# EAGLE design V1 (EAGLE 7.4.0)
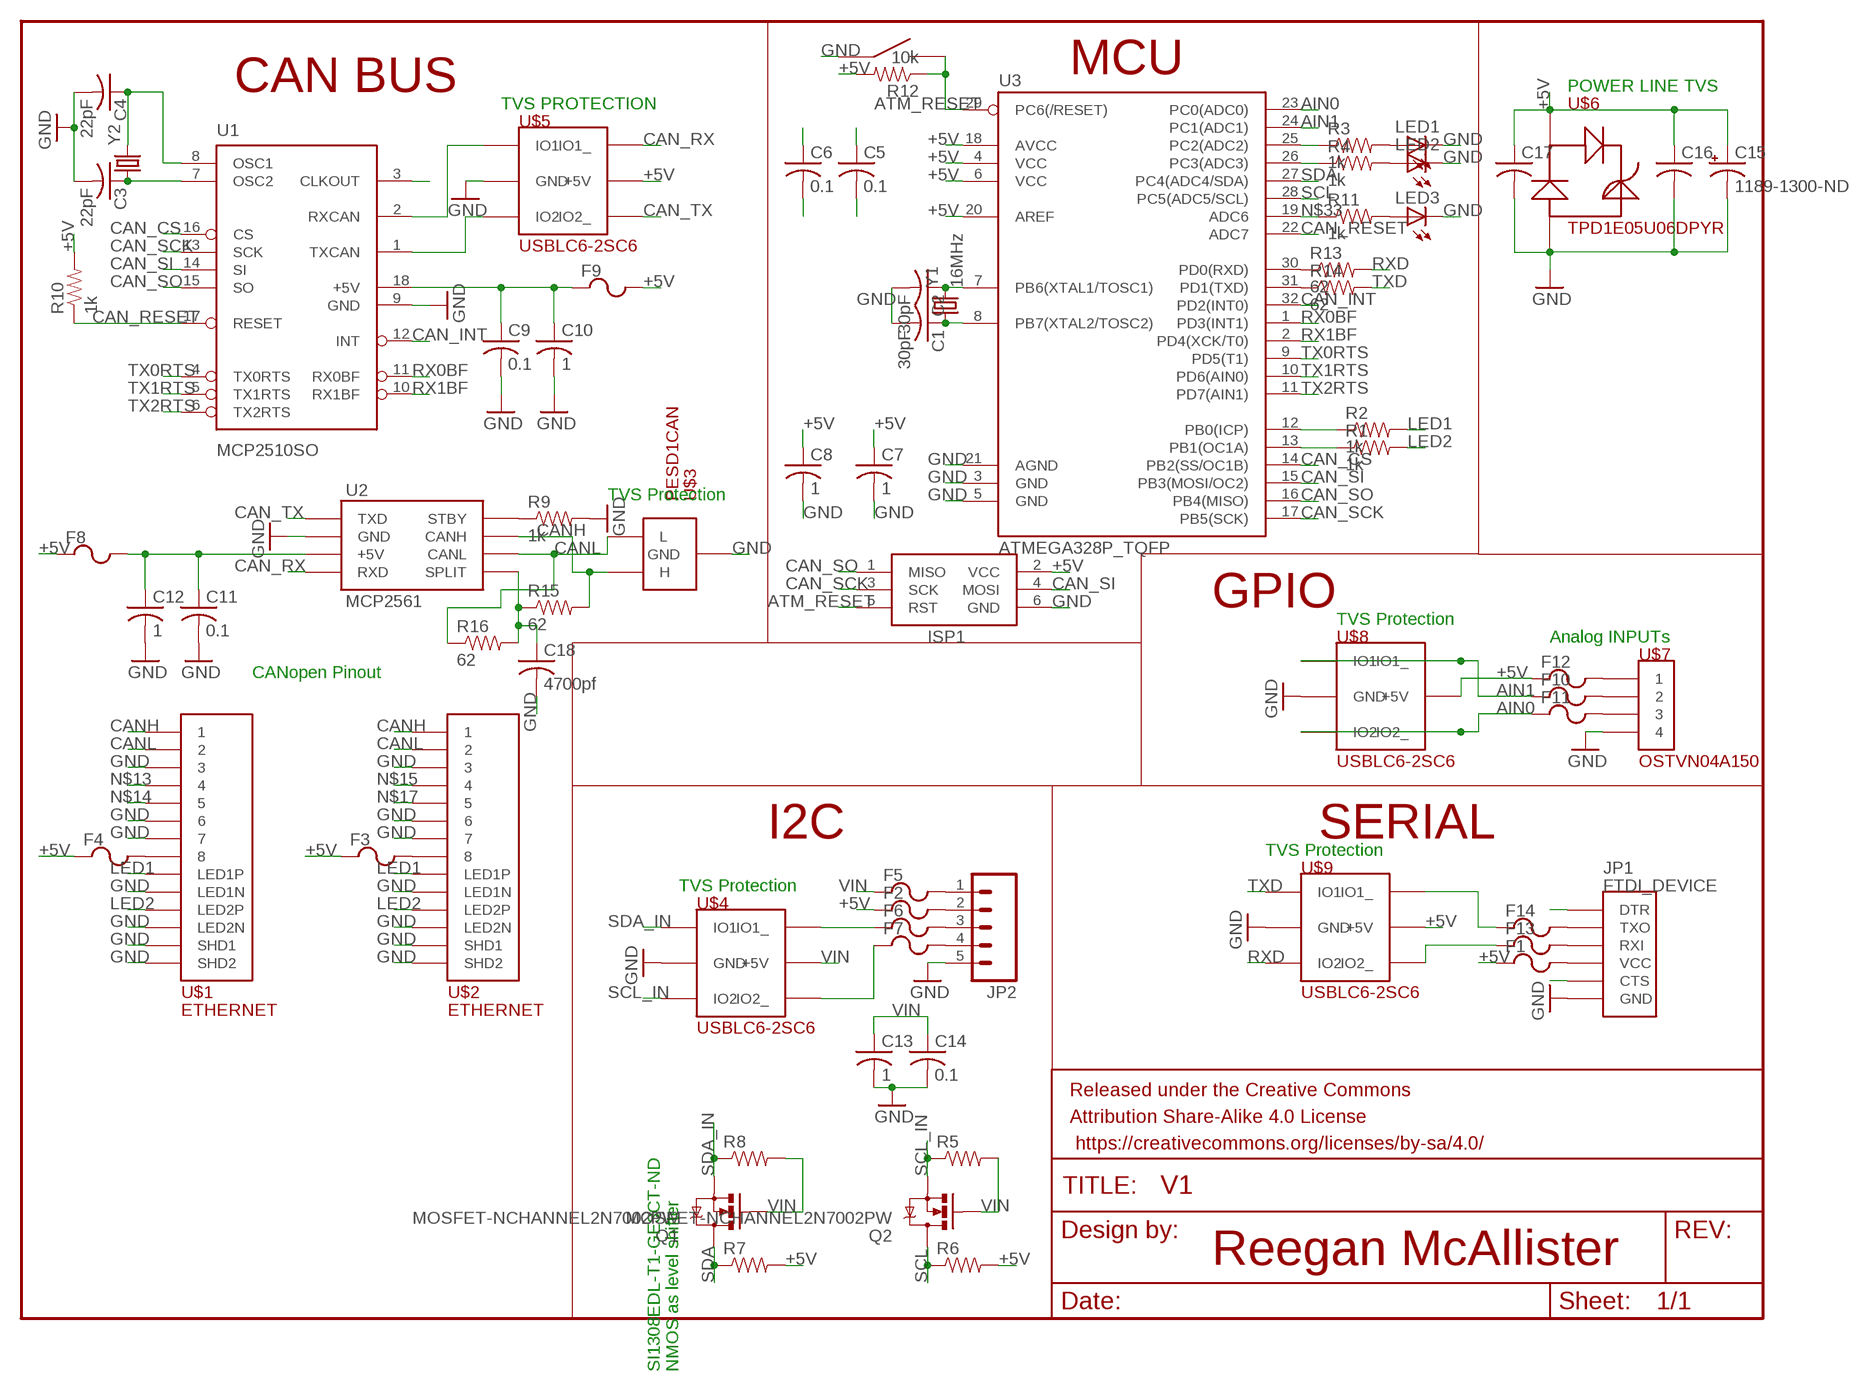
[diagram p0: schematic, sheet 1]

## Parts
C1  30pF  C-USC0603K  [C0603K]
C2  30pF  C-USC0603K  [C0603K]
C3  22pF  C-USC0603K  [C0603K]
C4  22pF  C-USC0603K  [C0603K]
C5  0.1  C-USC0603K  [C0603K]
C6  0.1  C-USC0603K  [C0603K]
C7  1  C-USC0603K  [C0603K]
C8  1  C-USC0603K  [C0603K]
C9  0.1  C-USC0603K  [C0603K]
C10  1  C-USC0603K  [C0603K]
C11  0.1  C-USC0603K  [C0603K]
C12  1  C-USC0603K  [C0603K]
C13  1  C-USC0603K  [C0603K]
C14  0.1  C-USC0603K  [C0603K]
C15  1189-1300-ND  [1189-1300-ND]
C16  C-USC0603K  [C0603K]
C17  C-USC0603K  [C0603K]
C18  4700pf  C-USC0603K  [C0603K]
F1  POLYFUSE  [1206]
F2  POLYFUSE  [1206]
F3  POLYFUSE  [1206]
F4  POLYFUSE  [1206]
F5  POLYFUSE  [1206]
F6  POLYFUSE  [1206]
F7  POLYFUSE  [1206]
F8  POLYFUSE  [1206]
F9  POLYFUSE  [1206]
F10  POLYFUSE  [1206]
F11  POLYFUSE  [1206]
F12  POLYFUSE  [1206]
F13  POLYFUSE  [1206]
F14  POLYFUSE  [1206]
FRAME1  FRAME-LETTERNO_PACKAGE  [DUMMY]
ISP1  AVRISP-BOX  [AVRISP-BOX]
JP1  FTDI_DEVICE  [FTDI_DEVICE_SIDE]
JP2  M05NO_SILK  [1X05_NO_SILK]
LED1  LEDCHIPLED_0805  [CHIPLED_0805]
LED2  LEDCHIPLED_0805  [CHIPLED_0805]
LED3  LEDCHIPLED_0805  [CHIPLED_0805]
Q1  MOSFET-NCHANNEL2N7002PW  [SOT323]
Q2  MOSFET-NCHANNEL2N7002PW  [SOT323]
R1  1k  RESISTOR0603-RES  [0603-RES]
R2  1k  RESISTOR0603-RES  [0603-RES]
R3  1k  RESISTOR0603-RES  [0603-RES]
R4  1k  RESISTOR0603-RES  [0603-RES]
R5  RESISTOR0603-RES  [0603-RES]
R6  RESISTOR0603-RES  [0603-RES]
R7  RESISTOR0603-RES  [0603-RES]
R8  RESISTOR0603-RES  [0603-RES]
R9  1k  RESISTOR0603-RES  [0603-RES]
R10  1k  RESISTOR0603-RES  [0603-RES]
R11  1k  RESISTOR0603-RES  [0603-RES]
R12  10k  RESISTOR0603-RES  [0603-RES]
R13  62  RESISTOR0603-RES  [0603-RES]
R14  62  RESISTOR0603-RES  [0603-RES]
R15  62  RESISTOR0603-RES  [0603-RES]
R16  62  RESISTOR0603-RES  [0603-RES]
U1  MCP2510SO  [SO-18W]
U2  MCP2561  [DIP8]
U3  ATMEGA328P_TQFP  [TQFP32-08]
U$1  ETHERNET  [A122645-ND]
U$2  ETHERNET  [A122645-ND]
U$3  PESD1CAN  [PESD1CAN]
U$4  USBLC6-2SC6  [USBLC6-2SC6]
U$5  USBLC6-2SC6  [USBLC6-2SC6]
U$6  TPD1E05U06DPYR  [2-XDFN]
U$7  OSTVN04A150  [OSTVN04A1450]
U$8  USBLC6-2SC6  [USBLC6-2SC6]
U$9  USBLC6-2SC6  [USBLC6-2SC6]
U$10  EG4621CT-ND  [EG4621CT-ND]
Y1  16MHz  CRYSTALHC49US  [HC49US]
Y2  CRYSTALHC49US  [HC49US]

## Nets
+5V: C5.1 C6.1 C7.1 C8.1 C15.P$2(+) C16.1 C17.1 F1.1 F2.1 F3.1 F4.1 F8.1 F9.2 F12.1 ISP1.2(VCC) R6.2 R7.2 R10.2 R12.2 U3.4(VCC) U3.6(VCC) U3.18(AVCC) U3.20(AREF) U$5.P$5(+5V) U$6.P$1 U$8.P$5(+5V) U$9.P$5(+5V)
AIN0: F11.1 U3.23(PC0(ADC0)) U$8.P$3(IO2) U$8.P$4(IO2_)
AIN1: F10.1 U3.24(PC1(ADC1)) U$8.P$1(IO1) U$8.P$6(IO1_)
ATM_RESET: ISP1.5(RST) R12.1 U3.29(PC6(/RESET)) U$10.P$3 U$10.P$4
CAN_CS: U1.16(CS) U3.14(PB2(SS/OC1B))
CAN_INT: U1.12(INT) U3.32(PD2(INT0))
CAN_RESET: R10.1 U1.17(RESET) U3.22(ADC7)
CAN_RX: U2.P$4(RXD) U$5.P$6(IO1_)
CAN_SCK: ISP1.3(SCK) U1.13(SCK) U3.17(PB5(SCK))
CAN_SI: ISP1.4(MOSI) U1.14(SI) U3.15(PB3(MOSI/OC2))
CAN_SO: ISP1.1(MISO) U1.15(SO) U3.16(PB4(MISO))
CAN_TX: U2.P$1(TXD) U$5.P$4(IO2_)
CANH: R15.2 U2.P$7(CANH) U$1.P$1 U$2.P$1 U$3.P$1(H)
CANL: R16.1 U2.P$6(CANL) U$1.P$2 U$2.P$2 U$3.P$2(L)
GND: C1.2 C2.2 C3.2 C4.2 C5.2 C6.2 C7.2 C8.2 C9.2 C10.2 C11.2 C12.2 C13.2 C14.2 C15.P$1(-) C16.2 C17.2 C18.2 ISP1.6(GND) JP1.P$6(GND) JP2.5 LED1.C LED2.C LED3.C R9.2 U1.9(GND) U2.P$2(GND) U3.3(GND) U3.5(GND) U3.21(AGND) U$1.P$3 U$1.P$6 U$1.P$7 U$1.P$9(LED1N) U$1.P$11(LED2N) U$1.P$13(SHD1) U$1.P$14(SHD2) U$2.P$3 U$2.P$6 U$2.P$7 U$2.P$9(LED1N) U$2.P$11(LED2N) U$2.P$13(SHD1) U$2.P$14(SHD2) U$3.P$3(GND) U$4.P$2(GND) U$5.P$2(GND) U$6.P$2 U$7.P$4 U$8.P$2(GND) U$9.P$2(GND) U$10.P$1 U$10.P$2
LED1: R2.2 U$1.P$10(LED1P) U$2.P$10(LED1P)
LED2: R1.2 U$1.P$12(LED2P) U$2.P$12(LED2P)
N$1: F3.2 U$2.P$8
N$2: R1.1 U3.13(PB1(OC1A))
N$3: R3.1 U3.25(PC2(ADC2))
N$4: R2.1 U3.12(PB0(ICP))
N$5: U1.3(CLKOUT)
N$6: C4.1 U1.8(OSC1) Y2.2
N$7: C3.1 U1.7(OSC2) Y2.1
N$8: C2.1 U3.7(PB6(XTAL1/TOSC1)) Y1.2
N$9: C1.1 U3.8(PB7(XTAL2/TOSC2)) Y1.1
N$10: F10.2 U$7.P$2
N$11: JP1.P$1(DTR)
N$12: JP1.P$5(CTS)
N$13: U$1.P$4
N$14: U$1.P$5
N$15: U$2.P$4
N$16: F11.2 U$7.P$3
N$17: U$2.P$5
N$18: LED1.A R3.2
N$20: LED2.A R4.2
N$21: F1.2 JP1.P$4(VCC)
N$22: F2.2 JP2.2
N$23: F4.2 U$1.P$8
N$24: F5.2 JP2.1
N$25: F6.2 JP2.3
N$26: F7.2 JP2.4
N$27: F6.1 U$4.P$6(IO1_)
N$28: F7.1 U$4.P$4(IO2_)
N$29: C11.1 C12.1 F8.2 U2.P$3(+5V)
N$30: C9.1 C10.1 F9.1 U1.18(+5V)
N$31: U1.1(TXCAN) U$5.P$3(IO2)
N$32: U1.2(RXCAN) U$5.P$1(IO1)
N$33: R11.1 U3.19(ADC6)
N$34: F12.2 U$7.P$1
N$35: R9.1 U2.P$8(STBY)
N$36: R4.1 U3.26(PC3(ADC3))
N$37: LED3.A R11.2
N$38: R13.1 U3.30(PD0(RXD))
N$39: R14.1 U3.31(PD1(TXD))
N$40: F13.2 JP1.P$3(RXI)
N$41: F14.2 JP1.P$2(TXO)
N$42: F14.1 U$9.P$6(IO1_)
N$43: F13.1 U$9.P$4(IO2_)
N$45: C18.1 R15.1 R16.2 U2.P$5(SPLIT)
RX0BF: U1.11(RX0BF) U3.1(PD3(INT1))
RX1BF: U1.10(RX1BF) U3.2(PD4(XCK/T0))
RXD: R13.2 U$9.P$3(IO2)
SCL: Q2.3(D) R6.1 U3.28(PC5(ADC5/SCL))
SCL_IN: Q2.2(S) R5.1 U$4.P$3(IO2)
SDA: Q1.3(D) R7.1 U3.27(PC4(ADC4/SDA))
SDA_IN: Q1.2(S) R8.1 U$4.P$1(IO1)
TX0RTS: U1.4(TX0RTS) U3.9(PD5(T1))
TX1RTS: U1.5(TX1RTS) U3.10(PD6(AIN0))
TX2RTS: U1.6(TX2RTS) U3.11(PD7(AIN1))
TXD: R14.2 U$9.P$1(IO1)
VIN: C13.1 C14.1 F5.1 Q1.1(G) Q2.1(G) R5.2 R8.2 U$4.P$5(+5V)

## Notes on the sheet
- MCU
- CAN BUS | POWER LINE TVS
- TVS PROTECTION
- TVS Protection
- GPIO
- TVS Protection
- Analog INPUTs
- CANopen Pinout
- I2C | SERIAL
- TVS Protection
- TVS Protection
- Reegan McAllister
- SI1308EDL-T1-GE3CT-ND 
  NMOS as level shifter

## Library data of the parts
C1-C14 C16-C18 = adafruit:C-US: CAPACITOR, American symbol
C15 = SparkFun-Capacitors-extra:1189-1300-ND
F1-F14 = polyfuse:POLYFUSE: Resistor Basic schematic elements and footprints for 0603, 1206, and PTH resistors.
FRAME1 = SparkFun-Aesthetics:FRAME-LETTER: Schematic Frame Standard 8.5x11 US Letter frame; DESIGNER: Nobody; VERSION: v01
ISP1 = adafruit:AVRISP: AVR ISP HEADER Standard 6 pin header for AVR programming
JP1 = SparkFun-Connectors:FTDI_DEVICE: Connector which mates to FTDI basic or FTDI cable.
JP2 = SparkFun-Connectors:M05: Header 5 Standard 5-pin 0.1" header. Use with straight break away headers (SKU : PRT-00116), right angle break away headers (PRT-00553), swiss pins (PRT-00743), machine pins (PRT-00117), and female headers (PRT-00115). Molex polarized connector foot print use with SKU : PRT-08230 with associated crimp pins and housings.
LED1-LED3 = adafruit:LED: LED OSRAM: - CHIPLED LG R971, LG N971, LY N971, LG Q971, LY Q971, LO R971, LY R971 LH N974, LH R974 LS Q976, LO Q976, LY Q976 LO Q996 - Hyper CHIPLED LW Q18S LB Q993, LB Q99A, LB R99A - SideLED LS A670, LO A670, LY A670, LG A670, LP A670 LB A673, LV A673, LT A673, LW A673 LH A674 LY A675 LS A676, LA A676, LO A676, LY A676, LW A676 LS A679, LY A679, LG A679 - Hyper Micro SIDELED® LS Y876, LA Y876, LO Y876, LY Y876 LT Y87S - SmartLED LW L88C, LW L88S LB L89C, LB L89S, LG L890 LS L89K, LO L89K, LY L89K LS L896, LA L896, LO L896, LY L896 - TOPLED LS T670, LO T670, LY T670, LG T670, LP T670 LSG T670, LSP T670, LSY T670, LOP T670, LYG T670 LG T671, LOG T671, LSG T671 LB T673, LV T673, LT T673, LW T673 LH T674 LS T676, LA T676, LO T676, LY T676, LB T676, LH T676, LSB T676, LW T676 LB T67C, LV T67C, LT T67C, LS T67K, LO T67K, LY T67K, LW E67C LS E67B, LA E67B, LO E67B, LY E67B, LB E67C, LV E67C, LT E67C LW T67C LS T679, LY T679, LG T679 LS T770, LO T770, LY T770, LG T770, LP T770 LB T773, LV T773, LT T773, LW T773 LH T774 LS E675, LA E675, LY E675, LS T675 LS T776, LA T776, LO T776, LY T776, LB T776 LHGB T686 LT T68C, LB T68C - Hyper Mini TOPLED® LB M676 - Mini TOPLED Santana® LG M470 LS M47K, LO M47K, LY M47K Source: http://www.osram.convergy.de/
Q1 Q2 = E-P-008-R1.2:MOSFET-NCHANNEL: Common NMOSFET Parts MFG P/N Store ID Prod ID FDD8780 TRANS-09984 SI7820DN TRANS-11055 FDS6630A IC-08089 2N7002PW TRANS-11151 FQP30N06L COM-10213 TRANS-10060 BSS123LT1G TRANS-08345 BSS138 TRANS-00830 BS170 2N7000; PROD_ID: TRANS-11151
R1-R16 = SparkFun-Resistors:RESISTOR: Resistor Basic schematic elements and footprints for 0603, 1206, and PTH resistors.
U1 = SparkFun-DigitalIC:MCP2510: CAN controller with SPI interface to any MCU. Original design by Microchip.; PROD_ID: IC-09906
U2 = mcp2561:MCP2561: CAN transceiver
U3 = SparkFun-DigitalIC:ATMEGA328P_TQFP; PROD_ID: IC-09069
U$1 U$2 = ETHERNET:ETHERNET: Ethernet port with 2 leds. digikey number A122645-ND
U$3 = PESD1CAN:PESD1CAN: TVS diode ESD protection specifically designed for CAN bus data lines
U$4 U$5 U$8 U$9 = USBLC6-2SC6:USBLC6-2SC6: 5V TSV diode for protecting circuit board inputs. Also has Vcc Protection. Digikey 497-5235-6-ND
U$6 = TPD1E05U06DPYR:TPD1E05U06DPYR: 5V general purpose TVS diode for ESD protection
U$7 = OSTVN04A150:OSTVN04A150: 4 port screw terminal. digikey number ED10563-ND
U$10 = EG4621CT-ND:EG4621CT-ND: surface mount push putton digikey number EG4621CT-ND
Y1 Y2 = SparkFun-FreqCtrl:CRYSTAL: Various standard crystals. Proven footprints.

## Board
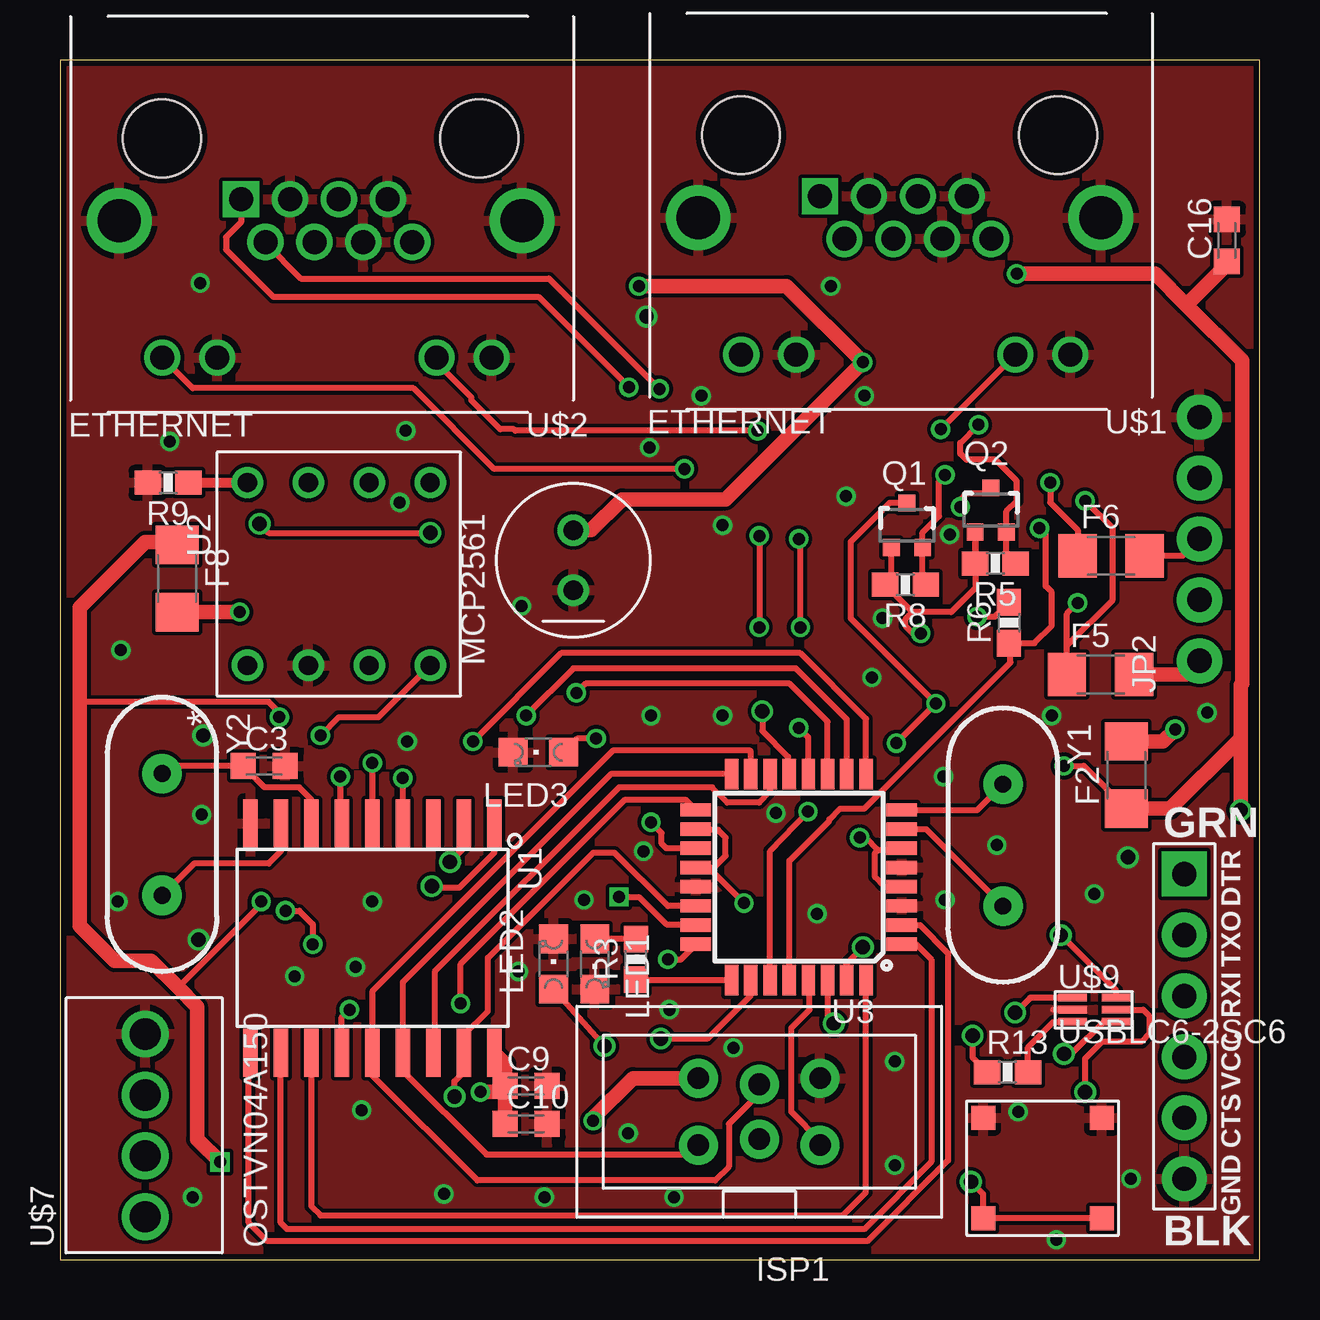
[diagram p1: board, top side]
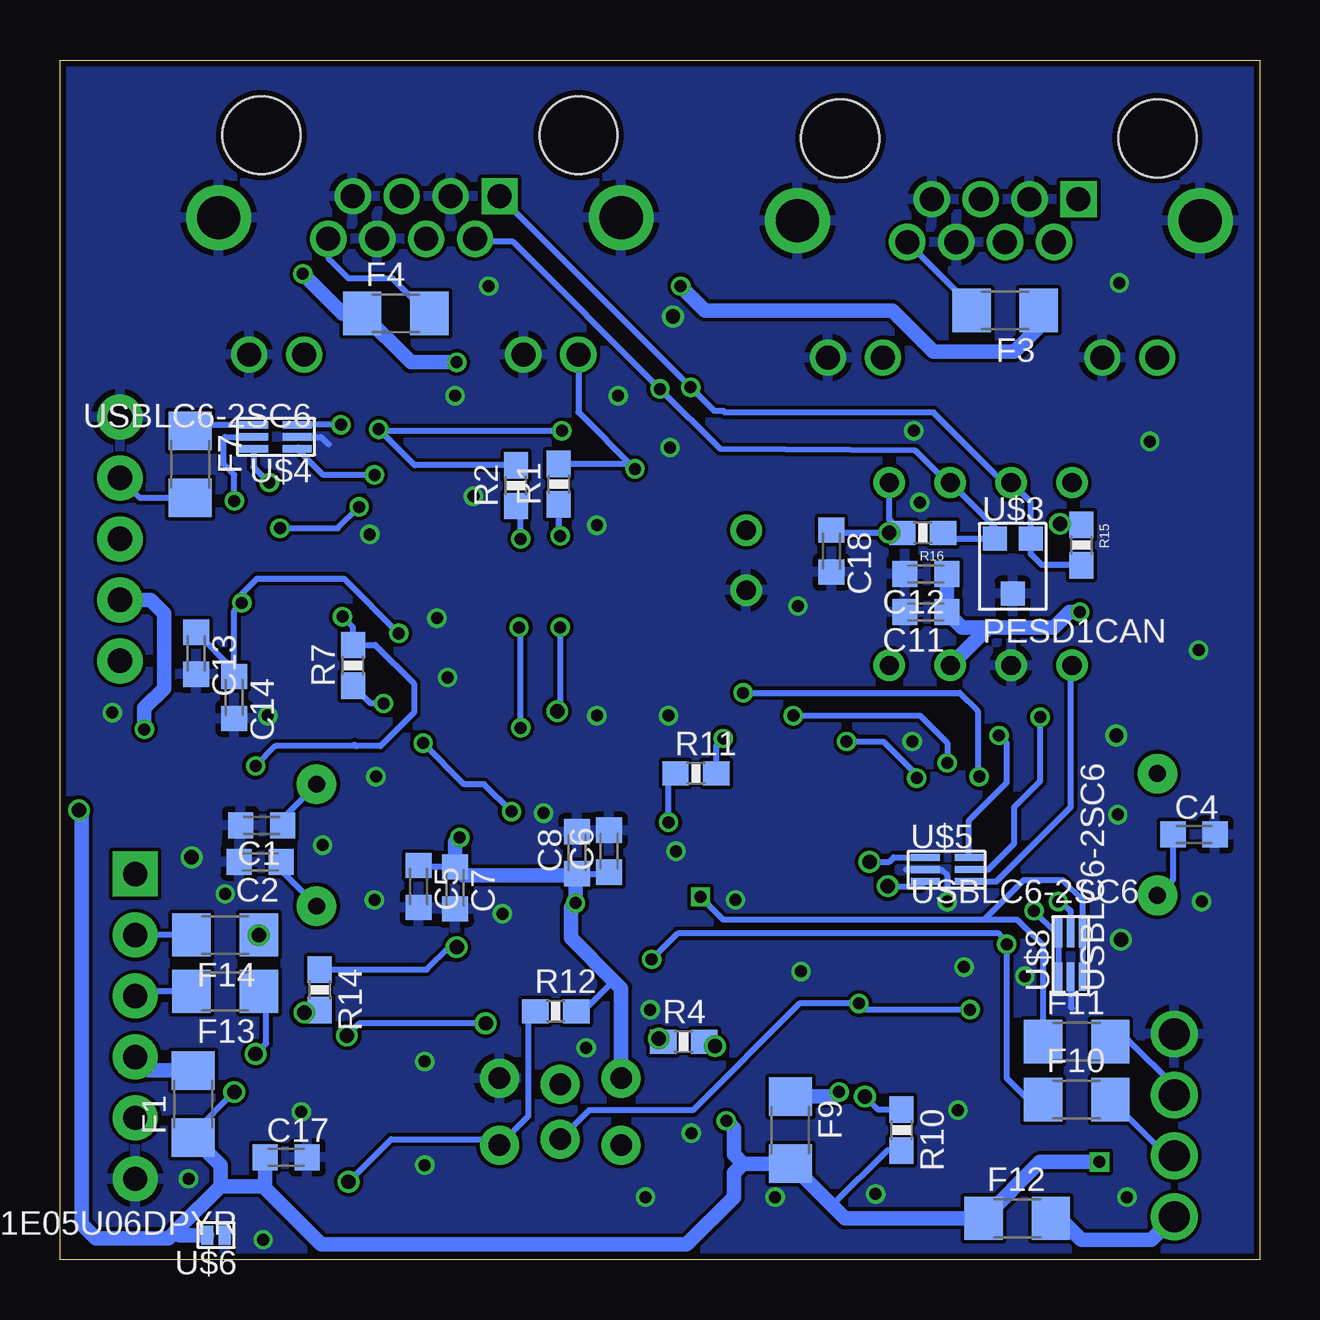
[diagram p2: board, bottom side, seen from below]

Size 50 x 50 mm. Coordinates in mm from the lower left corner, seen from the top.
Outline: 0,0 50,0 50,50 0,50 0,0
Copper layers (1*16): Top 0.035mm / dielectric 1.5mm / Bottom 0.035mm
Design rules "SeeedStudio_2layer_DRU_no_angle_20140221": minimum track width 6mil, minimum drill 12mil, track to track 6mil, track to pad 6mil, pad to pad 6mil, via to via 6mil, smd to smd 0mil, copper to edge 10mil, drill to drill 10mil, minimum pad ring 10mil, minimum via ring 6mil, stop-mask expansion 2mil, vias tented up to drill 100mil, thermal gap 10mil

### Footprints (pad centres in the part's own frame; a part is rotated, then mirrored left to right if it is on the bottom)
C0603K = smd 1.05 x 1.08: 1 -0.875,0; 2 0.875,0
1189-1300-ND = drill 0.8: P$1 -1.25,0; P$2 1.25,0
1206 = smd 1.6 x 1.8: 1 -1.4,0; 2 1.4,0
AVRISP-BOX = drill 0.9 pad 1.626: 1 -1.397,2.54; 2 1.397,2.54; 3 -1.143,0; 4 1.143,0; 5 -1.397,-2.54; 6 1.397,-2.54
FTDI_DEVICE_SIDE = drill 1.016 pad 1.88 square: P$1 -6.35,0 | drill 1.016 pad 1.88: P$2 -3.81,0; P$3 -1.27,0; P$4 1.27,0; P$5 3.81,0; P$6 6.35,0
1X05_NO_SILK = drill 1.016 pad 1.88: 1 0,0; 2 2.54,0; 3 5.08,0; 4 7.62,0; 5 10.16,0
CHIPLED_0805 = smd 1.2 x 1.2: A 0,-1.05; C 0,1.05
SOT323 = smd 0.7 x 0.7: 1 -0.65,-0.925; 2 0.65,-0.925; 3 0,0.925
0603-RES = smd 1.1 x 1: 1 -0.85,0; 2 0.85,0
SO-18W = smd 0.6 x 2: 1 -5.08,-4.788; 2 -3.81,-4.788; 3 -2.54,-4.788; 4 -1.27,-4.788; 5 0,-4.788; 6 1.27,-4.788; 7 2.54,-4.788; 8 3.81,-4.788; 9 5.08,-4.788; 10 5.08,4.788; 11 3.81,4.788; 12 2.54,4.788; 13 1.27,4.788; 14 0,4.788; 15 -1.27,4.788; 16 -2.54,4.788; 17 -3.81,4.788; 18 -5.08,4.788
DIP8 = drill 0.8: P$1 -3.81,6.35; P$2 -3.81,3.81; P$3 -3.81,1.27; P$4 -3.81,-1.27; P$5 3.81,-1.27; P$6 3.81,1.27; P$7 3.81,3.81; P$8 3.81,6.35
TQFP32-08 = smd 1.27 x 0.559: 1 -4.293,2.8; 2 -4.293,2; 3 -4.293,1.2; 4 -4.293,0.4; 5 -4.293,-0.4; 6 -4.293,-1.2; 7 -4.293,-2; 8 -4.293,-2.8; 17 4.293,-2.8; 18 4.293,-2; 19 4.293,-1.2; 20 4.293,-0.4; 21 4.293,0.4; 22 4.293,1.2; 23 4.293,2; 24 4.293,2.8 | smd 0.559 x 1.27: 9 -2.8,-4.293; 10 -2,-4.293; 11 -1.2,-4.293; 12 -0.4,-4.293; 13 0.4,-4.293; 14 1.2,-4.293; 15 2,-4.293; 16 2.8,-4.293; 25 2.8,4.293; 26 2,4.293; 27 1.2,4.293; 28 0.4,4.293; 29 -0.4,4.293; 30 -1.2,4.293; 31 -2,4.293; 32 -2.8,4.293
A122645-ND = drill 1 square: P$1 3.06,2.54 | drill 1: P$2 2.04,4.32; P$3 1.02,2.54; P$4 0,4.32; P$5 -1.02,2.54; P$6 -2.04,4.32; P$7 -3.06,2.54; P$8 -4.08,4.32; P$9 -7.38,9.14; P$10 -5.09,9.14; P$11 4.05,9.14; P$12 6.34,9.14 | drill 1.8: P$13 -8.65,3.43; P$14 8.13,3.43 | hole 3.25: -6.87,0; 6.35,0
PESD1CAN = smd 1 x 1: P$1 0.75,1.8; P$2 -0.75,1.8; P$3 0,-0.5
USBLC6-2SC6 = smd 0.3 x 1.2: P$1 -0.5,-0.91; P$2 0,-0.91; P$3 0.5,-0.91; P$4 0.5,0.91; P$5 0,0.91; P$6 -0.5,0.91
2-XDFN = smd 0.5 x 0.8: P$1 0.36,0; P$2 -0.36,0
OSTVN04A1450 = drill 1.3: P$1 -3.81,0; P$2 -1.27,0; P$3 1.27,0; P$4 3.81,0
EG4621CT-ND = smd 1 x 1: P$1 -2.475,2.1; P$2 2.475,2.1; P$3 -2.475,-2.1; P$4 2.475,-2.1
HC49US = drill 0.7 pad 1.651: 1 -2.54,0; 2 2.54,0

### Placement (x,y rotation side)
C1  41.59,18.1 180 bottom
C2  41.66,16.57 180 bottom
C3  8.51,20.57 0 top
C4  2.73,17.72 0 bottom
C5  35.05,15.56 270 bottom
C6  27.11,17.02 90 bottom
C7  33.53,15.49 270 bottom
C8  28.45,16.95 90 bottom
C9  19.43,7.24 0 top
C10  19.43,5.65 0 top
C11  13.91,26.99 180 bottom
C12  13.91,28.57 180 bottom
C13  44.32,25.27 270 bottom
C14  42.74,23.43 270 bottom
C15  21.4,29.15 90 top
C16  48.64,42.48 90 top
C17  40.58,4.25 0 bottom
C18  17.84,29.53 270 bottom
F1  44.45,6.48 90 bottom
F2  44.45,20.19 90 top
F3  10.6,39.56 180 bottom
F4  36,39.43 0 bottom
F5  43.37,24.38 0 top
F6  43.81,29.34 0 top
F7  44.58,33.15 270 bottom
F8  4.89,28.38 270 top
F9  19.56,5.4 270 bottom
F10  7.62,6.67 0 bottom
F11  7.62,9.08 0 bottom
F12  10.1,1.71 0 bottom
F13  43.12,11.18 180 bottom
F14  43.12,13.53 180 bottom
FRAME1  -30.48,19.05 0 top  (outside the outline)
ISP1  29.15,6.16 90 top
JP1  46.86,9.72 270 top
JP2  47.5,24.96 90 top
LED1  22.29,12.32 180 top
LED2  20.57,12.32 0 top
LED3  19.94,21.15 90 top
Q1  35.31,30.61 0 top
Q2  38.8,31.24 0 top
R1  29.21,32.32 90 bottom
R2  30.99,32.26 90 bottom
R3  24,12.51 90 top
R4  24,9.08 0 bottom
R5  38.99,29.02 180 top
R6  39.56,26.54 90 top
R7  37.78,24.77 90 bottom
R8  35.24,28.13 180 top
R9  4.51,32.38 180 top
R10  14.92,5.4 270 bottom
R11  23.5,20.26 0 bottom
R12  29.34,10.35 0 bottom
R13  39.5,7.81 0 top
R14  39.18,11.24 270 bottom
R15  7.43,29.78 270 bottom
R16  14.03,30.29 180 bottom
U1  13.02,13.4 180 top
U2  14.16,28.57 90 top
U3  30.8,15.94 180 top
U$1  34.73,46.86 180 top
U$2  10.6,46.74 180 top
U$3  10.29,28.26 0 bottom
U$4  41.02,34.29 90 bottom
U$5  13.02,16.26 270 bottom
U$6  43.5,1.02 180 bottom
U$7  3.56,5.59 90 top
U$8  7.87,12.7 0 bottom
U$9  43.12,10.41 270 top
U$10  40.96,3.81 0 top
Y1  39.31,17.27 270 top
Y2  4.25,17.72 270 top

### Tracks (layer width: path | path; a pad name or v marks a point on that pad's centre or on a via)
+5V  (via drill 0.5, 0.6)
  Top 0.254: 28.57,14.8 v28.51,14.86 27.03,16.34 U3.20 27.26,16.34 27.75,16.83 27.75,17.59 27.43,17.91 26.54,17.91 U3.18 | U3.4 34.37,15.54 33.97,15.94 33.97,16.95 34.1,17.08 | 34.1,17.08 35.03,17.08 U3.6 | v33.34,17.59 33.59,17.59 34.1,17.08 | 49.09,21.59 49.28,24 49.21,23.94 | v41.85,20.57 42.67,20.57 F2.1 | v38.23,26.8 38.97,26.8 R6.2 | v9.14,22.61 9.14,22.8 8.7,23.24 1.08,23.24 0.83,22.99 | v8.38,14.92 8.26,14.67 4.92,11.34 | U$9.P$5 45.15,10.41 45.4,10.16 45.4,9.4 45.09,9.08 43.43,9.08 42.74,8.38 v42.74,6.99
  Top 0.61: v24.13,40.58 30.29,40.58 v33.47,37.4 27.75,31.69 23.43,31.69 22.14,30.4 C15.P$2 | F2.1 46.29,18.79 49.09,21.59 | 49.28,24 49.28,37.47 46.96,39.78 | 46.96,39.78 45.66,41.08 v39.88,41.08 | v49.21,18.73 49.21,23.94 | F8.1 4.77,29.91 3.56,29.91 0.83,27.18 0.83,22.99 0.83,13.91 2.29,12.45 3.81,12.45 4.92,11.34 5.71,10.54 5.71,5.02 v6.67,4.06 | v22.23,5.78 22.23,5.91 23.88,7.56 ISP1.2 | C16.1 48.64,41.47 46.96,39.78
  Bottom 0.254: 28.51,16.02 C8.1 27.18,16.08 C6.1 | 33.17,16.02 C7.1 34.99,16.37 C5.1 | 33.53,17.4 v33.34,17.59 | 28.7,14.67 v28.51,14.86 | F3.1 9.2,38.87 | 37.66,21.4 36.64,21.4 35.24,22.8 35.24,24 36.85,25.61 R7.2 37.78,26.35 v38.23,26.8 | 37.66,21.4 37.72,21.46 | 37.66,21.4 41.02,21.4 v41.85,20.57 | U$5.P$5 11.3,16.26 10.22,17.34 10.22,18.86 9.14,19.94 v9.14,22.61 | U$8.P$5 7.87,14.54 v8.38,14.92 | R10.2 15.52,4.55 17.81,2.25 | R12.2 28.19,10.35 26.92,11.62 | F1.1 44.45,5.27 v42.74,6.99
  Bottom 0.61: v28.51,14.86 28.51,16.02 33.17,16.02 | C7.1 33.53,17.4 | 41.53,3.05 39.12,0.64 23.88,0.64 21.91,2.6 21.91,3.61 21.52,4 | v22.23,5.78 21.91,5.46 21.91,4.38 21.52,4 | ISP1.2 26.61,11.3 26.92,11.62 28.7,13.4 28.7,14.67 | 9.2,38.87 10.22,37.85 13.59,37.85 15.3,39.56 23.11,39.56 v24.13,40.58 | v33.47,37.4 35.37,37.4 F4.1 38.23,39.43 v39.88,41.08 | 41.53,3.05 43.31,3.05 | 43.31,3.05 45.02,1.33 | 45.02,1.33 45.47,0.89 48.51,0.89 49.09,1.46 49.09,18.61 v49.21,18.73 | F1.1 43.31,3.93 43.31,3.05 | 21.52,4 F9.2 17.81,2.25 17.27,1.71 F12.1 9.15,4.06 v6.67,4.06 | U$6.P$1 45.02,1.02 45.02,1.33 | C17.1 41.45,3.13 41.53,3.05
AIN0  (via drill 0.5)
  Top 0.254: v23.3,15.11 24.13,15.11 25.27,13.97 26.47,13.97 U3.23
  Bottom 0.254: F11.1 9.02,13.08 10.1,14.16 11.49,14.16 | 11.49,14.16 22.35,14.16 v23.3,15.11 | 11.49,14.16 9.84,15.81 8.19,15.81 7.37,14.99 U$8.P$4 U$8.P$3
AIN1  (via drill 0.5)
  Top 0.254: v25.34,12.51 25.88,12.51 U3.24 | v9.4,14.54 9.97,14.54 10.54,13.97 v10.54,13.14
  Bottom 0.254: F10.1 9.65,6.67 10.54,7.56 10.54,12.83 v10.54,13.14 10.54,13.27 10.86,13.59 24.26,13.59 v25.34,12.51 | U$8.P$1 U$8.P$6 8.47,13.61 v9.4,14.54
ATM_RESET  (via drill 0.6)
  Top 0.254: ISP1.5 31.69,4.95 30.48,6.16 30.48,9.65 31.24,10.41 31.24,11.6 U3.29 | U$10.P$4 U$10.P$3 38.48,2.73 v37.97,3.24
  Bottom 0.254: R12.1 30.48,10.35 30.48,5.97 ISP1.5 31.94,5.02 36.2,5.02 v37.97,3.24
CAN_CS
  Top 0.254: U3.14 29.6,19.5 29.15,19.05 27.81,19.05 27.18,19.68 23.3,19.68 15.62,12 15.62,8.67 U1.16
CAN_INT
  Top 0.254: U1.12 10.48,2.22 10.86,1.84 32.64,1.84 33.59,2.79 U3.32
CAN_RESET  (via drill 0.6)
  Top 0.254: 26.37,14.61 U3.22 | U3.22 | U3.22 25.34,14.73 23.11,16.95 22.23,16.95 17.84,12.57 17.84,10.35 16.83,9.34 U1.17 16.83,7.81 16.45,7.43 v16.45,6.79
  Bottom 0.254: R10.1 15.9,6.25 v16.45,6.79
CAN_RX  (via drill 0.5)
  Top 0.254: v10.86,21.84 11.62,22.61 13.27,22.61 U2.P$4
  Bottom 0.254: U$5.P$6 12.11,18.31 10.54,19.88 10.54,21.53 v10.86,21.84
CAN_SCK  (via drill 0.5)
  Top 0.254: 11.75,8.19 U1.13 11.75,10.1 v12.06,10.41 | U3.17 26.07,19.18 23.56,19.18 16.7,12.32 v16.7,10.67
  Bottom 0.254: v12.06,10.41 16.45,10.41 v16.7,10.67 19.18,10.67 23.62,6.22 27.94,6.22 ISP1.3
CAN_SI
  Top 0.254: U3.15 28.8,21.18 28.77,21.21 23.05,21.21 13.02,11.18 U1.14 13.02,7.68 17.4,3.3 27.3,3.3 27.88,3.87 27.88,5.65 29.15,6.92 ISP1.4
CAN_SO
  Top 0.254: U3.16 22.96,20.23 14.29,11.56 U1.15 14.29,7.87 17.78,4.38 26.23,4.38 ISP1.1
CAN_TX
  Bottom 0.254: U$5.P$4 10.98,15.76 7.87,18.86 7.87,24.7 U2.P$1
CANH  (via drill 0.5)
  Top 0.254: U$2.P$1 7.54,43.23 6.92,42.61 6.92,42.1 8.89,40.13 19.94,40.13 v23.71,36.36
  Bottom 0.254: U$1.P$1 v23.71,36.36 22.72,35.37 22.35,35.37 22.29,35.31 13.59,35.31 10.67,32.38 U2.P$7 9.54,31.57 U$3.P$1 9.54,29.41 9.08,28.96 7.45,28.96 R15.2
CANL  (via drill 0.5)
  Top 0.254: U$2.P$2 8.56,42.36 10.03,40.89 20.38,40.89 v24.99,36.29
  Bottom 0.254: U$1.P$2 32.57,42.42 31.11,42.42 v24.99,36.29 22.48,33.78 14.35,33.72 13.02,32.38 U2.P$6 11.04,30.53 U$3.P$2 12.95,30.06 R16.1
GND  (via drill 0.5, 0.6)
  Top 0.254: U$9.P$2 41.4,10.41
  Bottom 0.254: U$4.P$2 39.12,34.29 38.8,33.97 | 14.73,16.26 U$5.P$2 13.27,16.26 13.02,16 13.02,15.24 | U$8.P$2 7.87,10.54 7.81,10.48
  other vias: 29.84,18.61 27.62,22.67 36.89,14.99 31.56,14.41 24.32,17.02 25.4,10.41 23.69,5.27 34.8,3.94 34.8,8.26 39.94,6.16 28.07,8.83 16,2.73 12.32,12.19 5.97,21.84 5.91,18.54 19.24,27.24 2.54,25.4 19.11,12 21.84,14.99 39.05,17.27 33.85,24.26 33.53,36 24.45,39.31 5.84,40.7 24.64,22.67 41.53,0.83 43.12,15.24 32.13,40.58 47.82,22.8 32.77,31.81 41.34,22.67 36.83,20.13 44.51,16.76 34.29,26.73 14.41,34.54 9.78,11.81 13.02,14.92 5.52,2.6 5.78,13.34 20.19,2.6 25.59,2.6 44.64,3.37 37.08,30.23 26.73,36 4.57,34.1 2.41,14.92 12.57,6.22 27.62,30.61 24.57,33.85 14.16,31.56 14.48,21.59
  pour Bottom: -3.81,52.07 -3.81,-2.54 53.34,-2.54 53.34,52.07
  pour Top: -6.35,52.07 -6.35,-2.54 55.88,-2.54 55.88,52.07
LED1  (via drill 0.5)
  Top 0.254: U$2.P$10 15.69,37.39 17.14,35.94 17.14,35.81 18.35,34.61 18.92,34.61 18.99,34.54 v29.08,34.54 | v36.71,34.61 U$1.P$10
  Bottom 0.254: R2.2 35.21,33.11 v36.71,34.61 36.65,34.54 v29.08,34.54
LED2  (via drill 0.5)
  Top 0.254: v26.04,32.96 18.1,32.96 14.73,36.32 5.54,36.32 U$2.P$12
  Bottom 0.254: U$1.P$12 28.39,35.32 v26.04,32.96 26.25,33.17 R1.2
N$1
  Bottom 0.254: F3.2 12.01,39.74 U$2.P$8
N$2  (via drill 0.5, 0.6)
  Top 0.254: v29.15,30.16 v29.15,26.35 | v29.27,22.86 29.27,22.04 30.35,20.95 30.35,20.28 U3.13
  Bottom 0.254: R1.1 29.21,30.23 v29.15,30.16 | v29.15,26.35 29.15,22.99 v29.27,22.86
N$3
  Top 0.254: R3.1 27.98,11.66 U3.25
N$4  (via drill 0.5)
  Top 0.254: U3.12 31.2,21.76 v30.8,22.16 | v30.86,26.35 30.86,29.97 v30.8,30.04
  Bottom 0.254: v30.8,22.16 30.8,26.29 v30.86,26.35 | v30.8,30.04 30.8,31.22 R2.1
N$6
  Top 0.254: U1.8 9.21,17.02 8.7,16.51 5.59,16.51 Y2.2
  Bottom 0.254: C4.1 3.61,15.82 Y2.2
N$7
  Top 0.254: Y2.1 4.57,20.57 C3.1 8.52,19.68 9.97,19.68 10.48,19.18 U1.7
N$8
  Top 0.254: U3.7 36.1,17.94 Y1.2
  Bottom 0.254: C2.1 40.91,16.33 Y1.2
N$9
  Top 0.254: U3.8 38.23,18.74 Y1.1
  Bottom 0.254: C1.1 40.83,18.29 Y1.1
N$10
  Bottom 0.254: U$7.P$2 3.87,4.32 F10.2
N$16
  Bottom 0.254: U$7.P$3 3.56,7.24 5.46,9.14 6.16,9.14 F11.2
N$18
  Top 0.254: R3.2 22.62,13.36 LED1.A
N$20  (via drill 0.6)
  Top 0.254: v22.7,8.89 LED2.A
  Bottom 0.254: R4.2 v22.7,8.89
N$21
  Bottom 0.61: F1.2 46.29,7.88 JP1.P$4
N$22  (via drill 0.5)
  Top 0.61: F2.2 45.98,21.59 v46.48,22.1
  Bottom 0.61: v46.48,22.1 46.48,22.99 45.66,23.81 45.66,26.92 46.23,27.5 JP2.2
N$23
  Bottom 0.254: F4.2 34.67,39.43 36.13,40.89 37.97,40.89 38.8,41.72 38.8,42.53 U$1.P$8
N$24
  Top 0.61: F5.2 46.93,24.38 JP2.1
N$25
  Top 0.254: F6.2 46.8,29.34 JP2.3
N$26
  Bottom 0.254: F7.2 46.67,31.75 JP2.4
N$27  (via drill 0.5)
  Top 0.254: v41.27,32.38 41.27,31.56 42.42,30.42 F6.1
  Bottom 0.254: U$4.P$6 41.93,33.04 v41.27,32.38
N$28
  Bottom 0.254: U$4.P$4 44.33,34.79 F7.1
N$29  (via drill 0.5)
  Top 0.61: F8.2 v7.49,26.98 v7.49,26.99
  Bottom 0.61: v7.49,26.99 7.94,26.99 8.57,26.35 11.3,26.35 | 11.3,26.35 U2.P$3 | 11.3,26.35 12.4,26.35 C11.1 C12.1
N$30  (via drill 0.5)
  Top 0.61: C10.1 C9.1 | C9.1 18.56,8.15 U1.18 | v17.53,6.99 18.3,6.99 C9.1
  Bottom 0.61: F9.1 17.71,6.8 v17.53,6.99
N$31  (via drill 0.6)
  Top 0.254: U1.1 18.1,16.95 16.64,15.49 15.56,15.49 v15.49,15.56
  Bottom 0.254: v15.49,15.56 14.13,15.56 U$5.P$3
N$32  (via drill 0.6)
  Top 0.254: U1.2 16.83,17.14 v16.26,16.57
  Bottom 0.254: v16.26,16.57 15.43,16.57 15.24,16.76 U$5.P$1
N$33  (via drill 0.5)
  Top 0.254: U3.19 25.28,17.14 25.08,17.34 25.08,17.78 v24.64,18.22
  Bottom 0.254: v24.64,18.22 24.64,19.96 R11.1
N$34
  Bottom 0.61: F12.2 8.32,1.71 7.43,0.83 4.51,0.83 U$7.P$1
N$35
  Top 0.406: R9.1 U2.P$8
N$36  (via drill 0.6)
  Top 0.254: U3.26 28.8,11.02 26.99,9.21 v25.04,9.21
  Bottom 0.254: v25.04,9.21 R4.1
N$37  (via drill 0.5)
  Top 0.254: v22.35,21.72 21.56,21.72 LED3.A
  Bottom 0.254: R11.2 22.64,21.42 v22.35,21.72
N$38  (via drill 0.6)
  Top 0.254: U3.30 32,10.1 v32.26,9.84 | v38.04,9.34 38.04,8.42 R13.1
  Bottom 0.254: v32.26,9.84 37.53,9.84 v38.04,9.34
N$39  (via drill 0.6)
  Top 0.254: v33.47,13.02 32.77,12.32 32.77,11.68 U3.31
  Bottom 0.254: R14.1 34.71,12.09 33.78,13.02 v33.47,13.02
N$40
  Bottom 0.254: F13.2 46.67,11.18 JP1.P$3
N$41
  Bottom 0.254: F14.2 JP1.P$2
N$42  (via drill 0.6)
  Top 0.254: U$9.P$6 44.03,11.22 F14.1
  Bottom 0.254: 41.4,13.02 41.72,13.33 F14.1 41.4,13.21 41.4,13.02 | 41.4,13.02 41.4,12.95
  other vias: 41.72,13.53
N$43  (via drill 0.6)
  Top 0.254: U$9.P$4 43.51,9.91 42.23,8.64 41.91,8.64 v41.85,8.57
  Bottom 0.254: v41.85,8.57 41.4,9.02 41.4,10.86 F13.1
N$45  (via drill 0.6)
  Top 0.254: v8.32,30.67 8.7,30.29 v15.43,30.29
  Bottom 0.254: C18.1 17.84,30.29 v15.43,30.29 R16.2 15.43,30.84 U2.P$5 | R15.1 7.47,30.67 v8.32,30.67
RX0BF
  Top 0.254: U1.11 9.21,1.52 9.46,1.27 33.53,1.27 36.32,4.06 36.32,12.51 35.69,13.14 U3.1
RX1BF
  Top 0.254: U1.10 7.87,8.55 7.87,1.52 8.64,0.76 33.66,0.76 37.02,4.13 37.02,12.76 35.85,13.94 U3.2
RXD
  Top 0.254: R13.2 40.35,8.85 41.4,9.91 42.2,9.91 U$9.P$3
SCL  (via drill 0.5)
  Top 0.254: U3.28 30.4,16.62 32.07,18.29 32.07,18.35 32.51,18.8 33.53,18.8 39.62,24.89 39.62,25.63 R6.1 40.62,25.69 41.34,26.42 41.34,27.81 41.08,28.07 41.08,30.23 v40.83,30.48 | v37.53,31.37 37.53,31.69 37.78,31.94 38.57,31.94 Q2.3
  Bottom 0.254: v40.83,30.48 38.42,30.48 v37.53,31.37
SCL_IN  (via drill 0.5)
  Top 0.254: R5.1 39.45,29.02 Q2.2 39.45,31.19 39.88,31.62 39.88,32.45 38.99,33.34 37.78,33.34 37.53,33.59 37.53,34.04 v38.29,34.8
  Bottom 0.254: v38.29,34.8 U$4.P$3
SDA  (via drill 0.5)
  Top 0.254: U3.27 29.6,17.02 v31.18,18.67 | v34.86,21.53 v36.51,23.18 32.96,26.73 32.96,29.91 34.58,31.53 Q1.3
  Bottom 0.254: v31.18,18.67 32.32,19.81 33.15,19.81 v34.86,21.53 | v36.51,23.18 37.05,23.18 R7.1
SDA_IN  (via drill 0.5)
  Top 0.254: R8.1 35.96,28.13 Q1.2 35.96,30.3 36.64,30.99 36.64,32.45 v36.89,32.7
  Bottom 0.254: 40.06,33.85 U$4.P$1 39.02,32.7 v36.89,32.7
TX0RTS  (via drill 0.5)
  Top 0.254: U3.9 33.6,22.54 30.86,25.27 20.89,25.27 v17.21,21.59 | v14.29,20.07 U1.4
  Bottom 0.254: v17.21,21.59 15.68,21.59 14.29,20.19 v14.29,20.07
TX1RTS  (via drill 0.5)
  Top 0.254: U3.10 32.8,22.51 30.67,24.64 21.4,24.64 v19.43,22.67 | v13.02,20.7 U1.5
  Bottom 0.254: v19.43,22.67 14.16,22.67 13.02,21.53 v13.02,20.7
TX2RTS  (via drill 0.5)
  Top 0.254: U3.11 32,22.42 30.42,24 21.91,24 v21.53,23.62 | v11.68,20.13 11.68,18.25 U1.6
  Bottom 0.254: v21.53,23.62 12.51,23.62 11.75,22.86 11.75,20.19 v11.68,20.13
TXD  (via drill 0.6)
  Top 0.254: U$9.P$1 40.44,10.91 v39.81,10.29
  Bottom 0.254: v39.81,10.29 39.28,10.29 R14.2
VIN  (via drill 0.5)
  Top 0.254: Q1.1 34.66,28.13 R8.2 35.53,26.99 | R5.2 Q2.1 38.15,27.99 37.15,26.99 35.53,26.99 | F5.1 41.97,25.59 | 41.97,25.59 43.88,27.5 43.88,30.48 v42.74,31.62 | 41.97,25.59 41.97,26.92 v42.42,27.37 | v35.88,26.1 35.56,26.1 35.24,26.42 35.24,26.7 35.53,26.99
  Bottom 0.254: v42.74,31.62 42.74,32.7 43.18,33.15 43.18,34.23 43.12,34.29 U$4.P$5 | v35.88,26.1 38.16,28.38 41.78,28.38 42.42,27.75 v42.42,27.37 42.74,27.05 C14.1 42.74,24.56 C13.1